# EAGLE design io-usb (EAGLE 9.3.0)
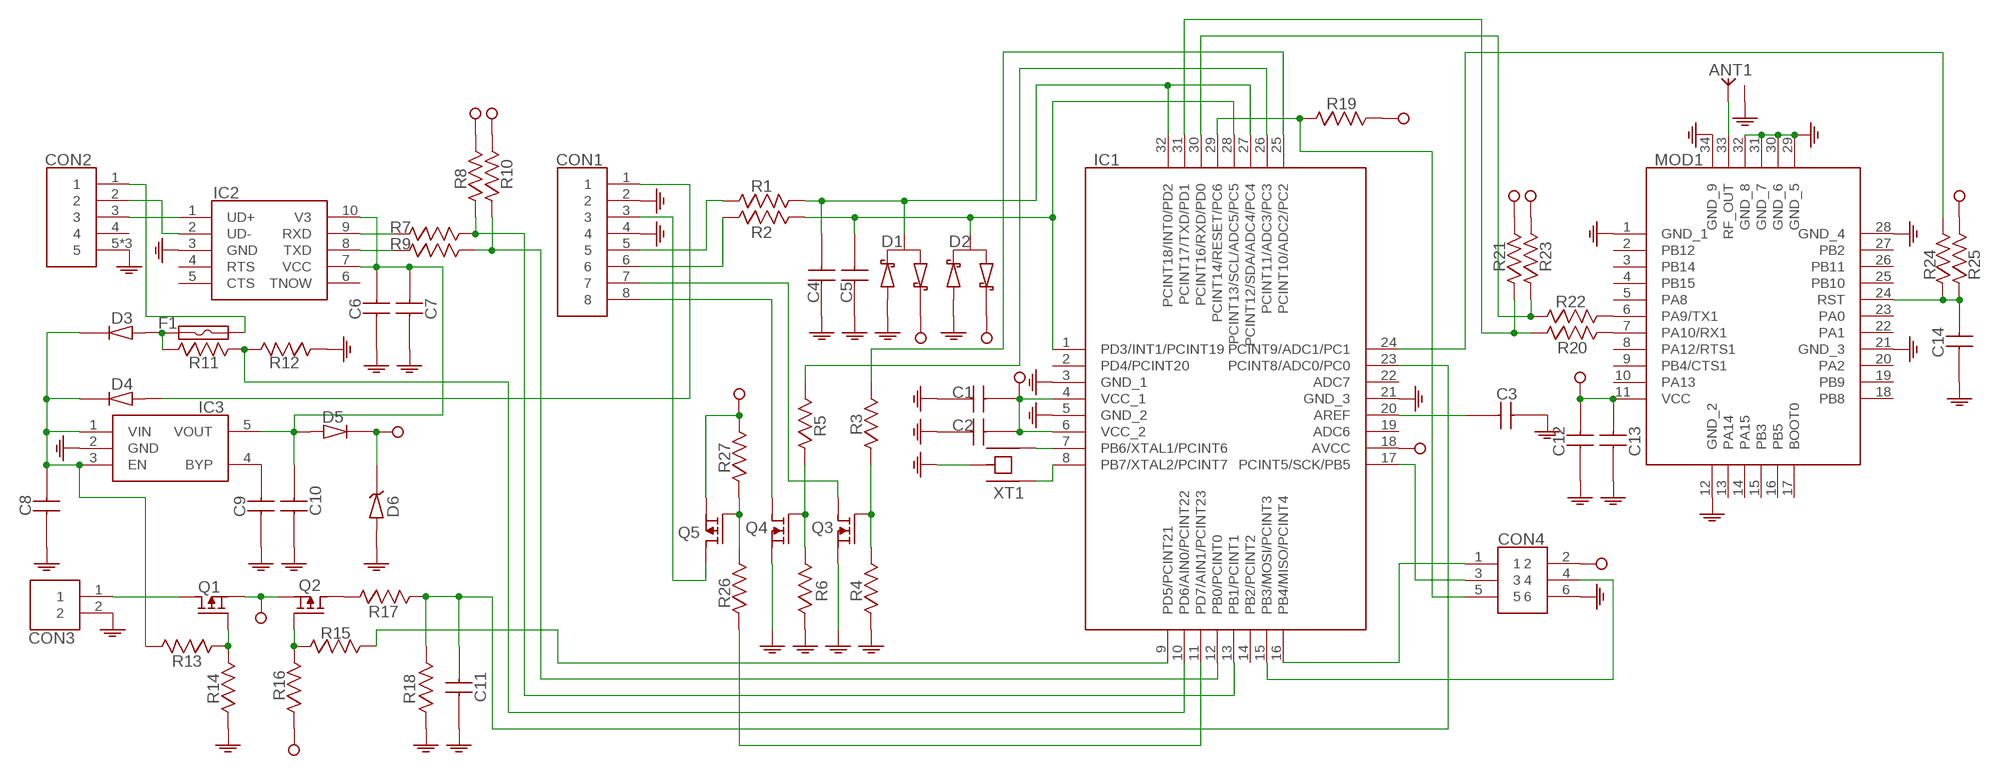
[diagram p0: schematic, sheet 1]

## Parts
ANT1  SMA-RF  [SMA-RF]
C1  CAPACITOR-0805  [0805]
C2  CAPACITOR-0603  [0603]
C3  CAPACITOR-0603  [0603]
C4  CAPACITOR-0603  [0603]
C5  CAPACITOR-0603  [0603]
C6  CAPACITOR-0805  [0805]
C7  CAPACITOR-0603  [0603]
C8  CAPACITOR-0805  [0805]
C9  CAPACITOR-0603  [0603]
C10  CAPACITOR-0805  [0805]
C11  CAPACITOR-0603  [0603]
C12  CAPACITOR-0603  [0603]
C13  CAPACITOR-0805  [0805]
C14  CAPACITOR-0603  [0603]
CON1  CON-89-3_81-PLUG  [CON-8P-3_81-PLUG]
CON2  USB-MICRO-DIP-VER  [USB-MICRO-DIP-VER]
CON3  JST-PH-2-2.0MM  [JST-PH-2-2.0MM]
CON4  ISP  [ISP]
D1  SCHOTTKY-SERIE-3P  [SOT23-3]
D2  SCHOTTKY-SERIE-3P  [SOT23-3]
D3  DIODE-SOD123  [SOD123-DIODE]
D4  DIODE-SOD123  [SOD123-DIODE]
D5  DIODE-SOD123  [SOD123-DIODE]
D6  ZENER-SOD123  [SOD123-DIODE]
F1  FUSE-0805  [0805]
IC1  ATMEGA328P-AU  [TQFP-32]
IC2  CH340E  [MSOP-10]
IC3  MIC5219  [SOT23-5]
MOD1  RAK811  [RAK811]
Q1  P-MOSFET  [SOT23-3]
Q2  P-MOSFET  [SOT23-3]
Q3  N-MOSFET  [SOT23-3]
Q4  N-MOSFET  [SOT23-3]
Q5  P-MOSFET  [SOT23-3]
R1  RESISTOR-0805  [0805]
R2  RESISTOR-0805  [0805]
R3  RESISTOR-0603  [0603]
R4  RESISTOR-0603  [0603]
R5  RESISTOR-0603  [0603]
R6  RESISTOR-0603  [0603]
R7  RESISTOR-0603  [0603]
R8  RESISTOR-0603  [0603]
R9  RESISTOR-0603  [0603]
R10  RESISTOR-0603  [0603]
R11  RESISTOR-0603  [0603]
R12  RESISTOR-0603  [0603]
R13  RESISTOR-0603  [0603]
R14  RESISTOR-0603  [0603]
R15  RESISTOR-0603  [0603]
R16  RESISTOR-0603  [0603]
R17  RESISTOR-0603  [0603]
R18  RESISTOR-0603  [0603]
R19  RESISTOR-0603  [0603]
R20  RESISTOR-0603  [0603]
R21  RESISTOR-0603  [0603]
R22  RESISTOR-0603  [0603]
R23  RESISTOR-0603  [0603]
R24  RESISTOR-0603  [0603]
R25  RESISTOR-0603  [0603]
R26  RESISTOR-0603  [0603]
R27  RESISTOR-0603  [0603]
XT1  RESONATOR-3215  [RESONATOR-3215]

## Nets
GND: ANT1.2(GND) ANT1.3(GND) ANT1.4(GND) ANT1.5(GND) C1.1 C2.1 C3.2 C4.1 C5.1 C6.1 C7.1 C8.1 C9.2 C10.1 C11.1 C12.1 C13.1 C14.1 CON1.2 CON1.4 CON2.5 CON2.6 CON2.7 CON3.2 CON4.6 D1.1 D2.1 D6.2(A) IC1.3(GND_1) IC1.5(GND_2) IC1.21(GND_3) IC2.3(GND) IC3.2(GND) MOD1.1(GND_1) MOD1.12(GND_2) MOD1.21(GND_3) MOD1.28(GND_4) MOD1.29(GND_5) MOD1.30(GND_6) MOD1.31(GND_7) MOD1.32(GND_8) MOD1.34(GND_9) Q3.2(S) Q4.2(S) R4.1 R6.1 R12.1 R14.1 R18.1 XT1.3
N$1: D3.2(A) F1.2 R11.1
N$2: C9.1 IC3.4(BYP)
N$3: IC2.9(RXD) R7.1
N$4: IC2.8(TXD) R9.1
N$5: CON2.3 IC2.1(UD+)
N$6: CON2.2 IC2.2(UD-)
N$8: CON3.1 Q1.3(D)
N$9: IC1.7(PB6/XTAL1/PCINT6) XT1.1
N$10: CON2.1 F1.1
N$11: IC1.8(PB7/XTAL2/PCINT7) XT1.2
N$12: IC1.9(PD5/PCINT21) R15.2
N$13: C8.2 D3.1(K) D4.1(K) IC3.1(VIN) IC3.3(EN) R13.2
N$14: Q2.1(G) R15.1 R16.2
N$15: C11.2 IC1.23(PCINT8/ADC0/PC0) R17.2 R18.2
N$16: CON1.1 D4.2(A)
N$17: ANT1.1(ANT) MOD1.33(RF_OUT)
N$18: MOD1.6(PA9/TX1) R22.2
N$19: MOD1.7(PA10/RX1) R20.2
N$20: C14.2 MOD1.24(RST) R24.1 R25.1
N$21: IC1.30(PCINT16/RXD/PD0) R22.1 R23.1
N$22: IC1.31(PCINT17/TXD/PD1) R20.1 R21.1
N$23: CON4.5 IC1.29(PCINT14/RESET/PC6) R19.1
N$24: IC1.13(PB1/PCINT1) R7.2 R8.1
N$25: C4.2 D1.3 IC1.27(PCINT12/SDA/ADC4/PC4) IC1.32(PCINT18/INT0/PD2) R1.2
N$26: IC1.12(PB0/PCINT0) R9.2 R10.1
N$27: CON1.6 R2.1
N$28: C5.2 D2.3 IC1.1(PD3/INT1/PCINT19) IC1.28(PCINT13/SCL/ADC5/PC5) R2.2
N$29: CON1.5 R1.1
N$30: Q4.1(G) R5.1 R6.2
N$31: Q3.1(G) R3.1 R4.2
N$32: IC1.26(PCINT11/ADC3/PC3) R5.2
N$33: IC1.25(PCINT10/ADC2/PC2) R3.2
N$34: CON1.7 Q3.3(D)
N$35: CON1.8 Q4.3(D)
N$36: IC1.24(PCINT9/ADC1/PC1) R24.2
N$37: Q1.1(G) R13.1 R14.2
N$38: Q2.3(D) R17.1
N$39: IC1.10(PD6/AIN0/PCINT22) R11.2 R12.2
N$40: CON4.3 IC1.17(PCINT5/SCK/PB5)
N$41: CON4.1 IC1.16(PB4/MISO/PCINT4)
N$42: CON4.4 IC1.15(PB3/MOSI/PCINT3)
N$43: C3.1 IC1.20(AREF)
N$44: Q5.1(G) R26.2 R27.1
N$45: CON1.3 Q5.3(D)
N$46: IC1.11(PD7/AIN1/PCINT23) R26.1
N$47: C6.2 C7.2 C10.2 D5.2(A) IC2.7(VCC) IC2.10(V3) IC3.5(VOUT)
VCC: C1.2 C2.2 C12.2 C13.2 CON4.2 D1.2 D2.2 D5.1(K) D6.1(K) IC1.4(VCC_1) IC1.6(VCC_2) IC1.18(AVCC) MOD1.11(VCC) Q1.2(S) Q2.2(S) Q5.2(S) R8.2 R10.2 R16.1 R19.2 R21.2 R23.2 R25.2 R27.2
Unconnected: CON2.4 IC1.14(PB2/PCINT2) IC1.19(ADC6) IC1.22(ADC7) IC2.4(RTS) IC2.5(CTS) IC2.6(TNOW) MOD1.2(PB12) MOD1.3(PB14) MOD1.4(PB15) MOD1.5(PA8) MOD1.8(PA12/RTS1) MOD1.9(PB4/CTS1) MOD1.10(PA13) MOD1.13(PA14) MOD1.14(PA15) MOD1.15(PB3) MOD1.16(PB5) MOD1.17(BOOT0) MOD1.18(PB8) MOD1.19(PB9) MOD1.20(PA2) MOD1.22(PA1) MOD1.23(PA0) MOD1.25(PB10) MOD1.26(PB11) MOD1.27(PB2)

## Power pins joined to a net without a drawn wire
PD4/PCINT20: IC1.2(PD4/PCINT20)

## Library data of the parts
ANT1 = SamacSys_Parts:SMA-RF
C1 C6 C8 C10 C13 = SamacSys_Parts:CAPACITOR-0805
C2-C5 C7 C9 C11 C12 C14 = SamacSys_Parts:CAPACITOR-0603
CON1 = SamacSys_Parts:CON-89-3_81-PLUG
CON2 = SamacSys_Parts:USB-MICRO-DIP-VER
CON3 = SamacSys_Parts:JST-PH-2-2.0MM
CON4 = SamacSys_Parts:ISP
D1 D2 = SamacSys_Parts:SCHOTTKY-SERIE-3P
D3-D5 = SamacSys_Parts:DIODE-SOD123
D6 = SamacSys_Parts:ZENER-SOD123
F1 = SamacSys_Parts:FUSE-0805
IC1 = SamacSys_Parts:ATMEGA328P-AU
IC2 = SamacSys_Parts:CH340E
IC3 = SamacSys_Parts:MIC5219
MOD1 = SamacSys_Parts:RAK811
Q1 Q2 Q5 = SamacSys_Parts:P-MOSFET
Q3 Q4 = SamacSys_Parts:N-MOSFET
R1 R2 = SamacSys_Parts:RESISTOR-0805
R3-R27 = SamacSys_Parts:RESISTOR-0603
XT1 = SamacSys_Parts:RESONATOR-3215

## Board
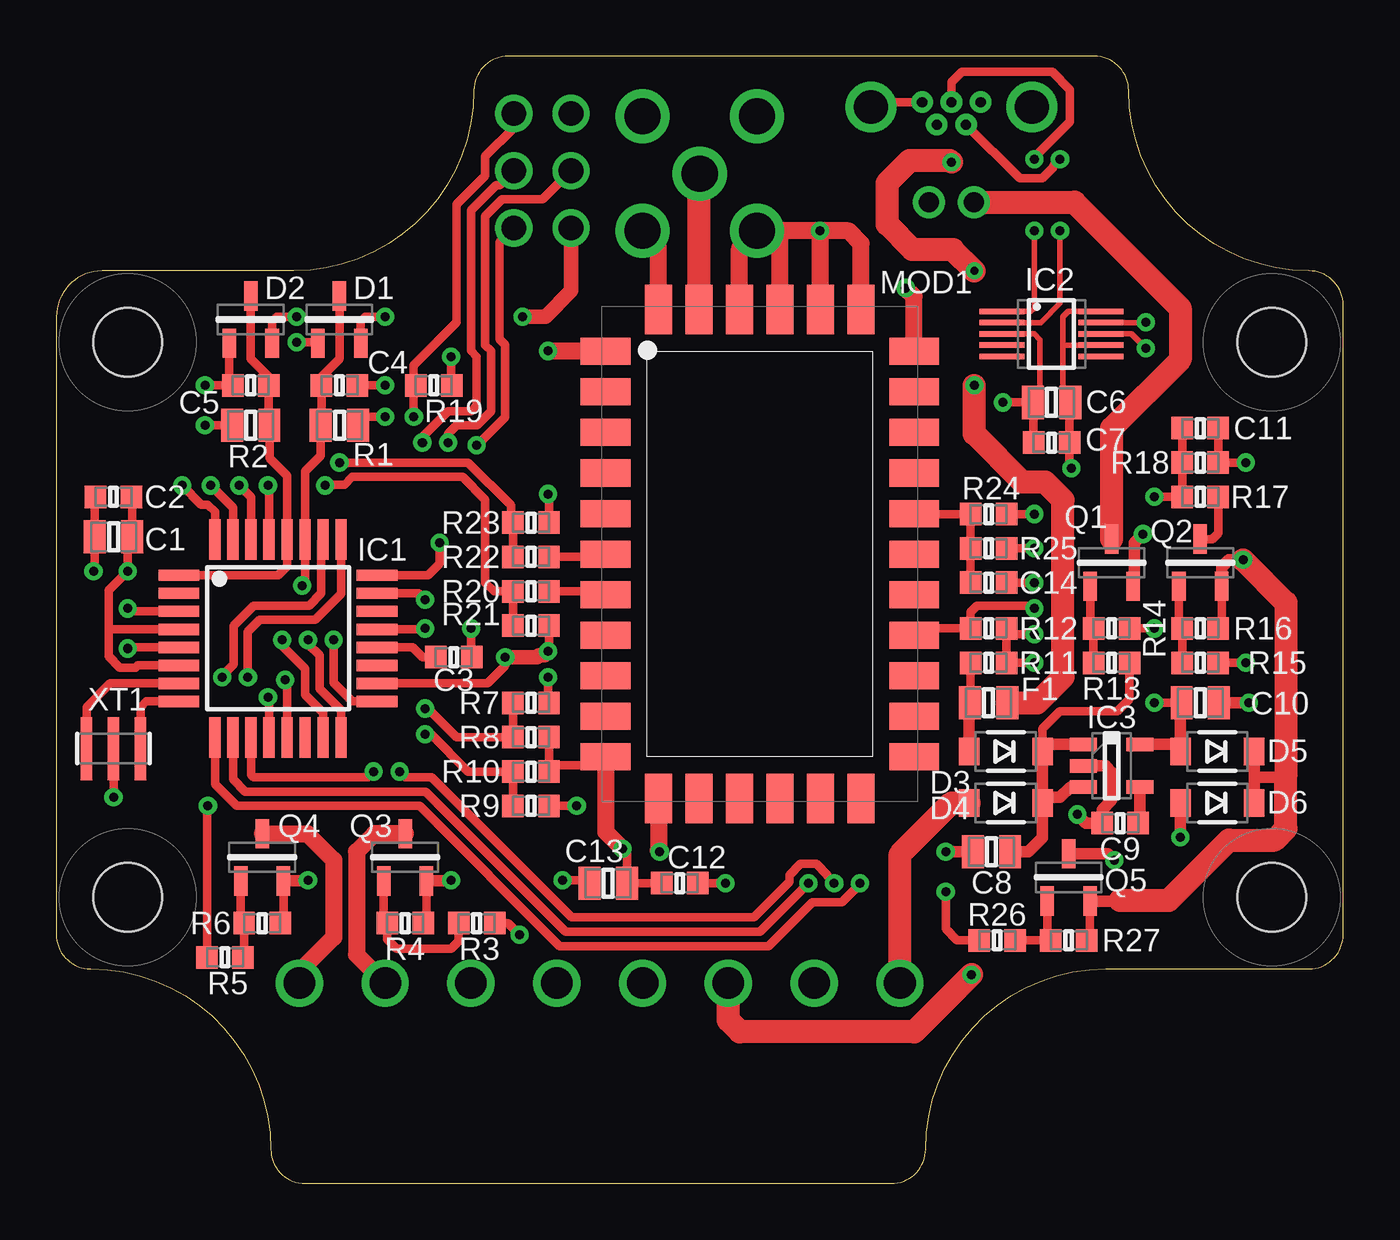
[diagram p1: board, top side]
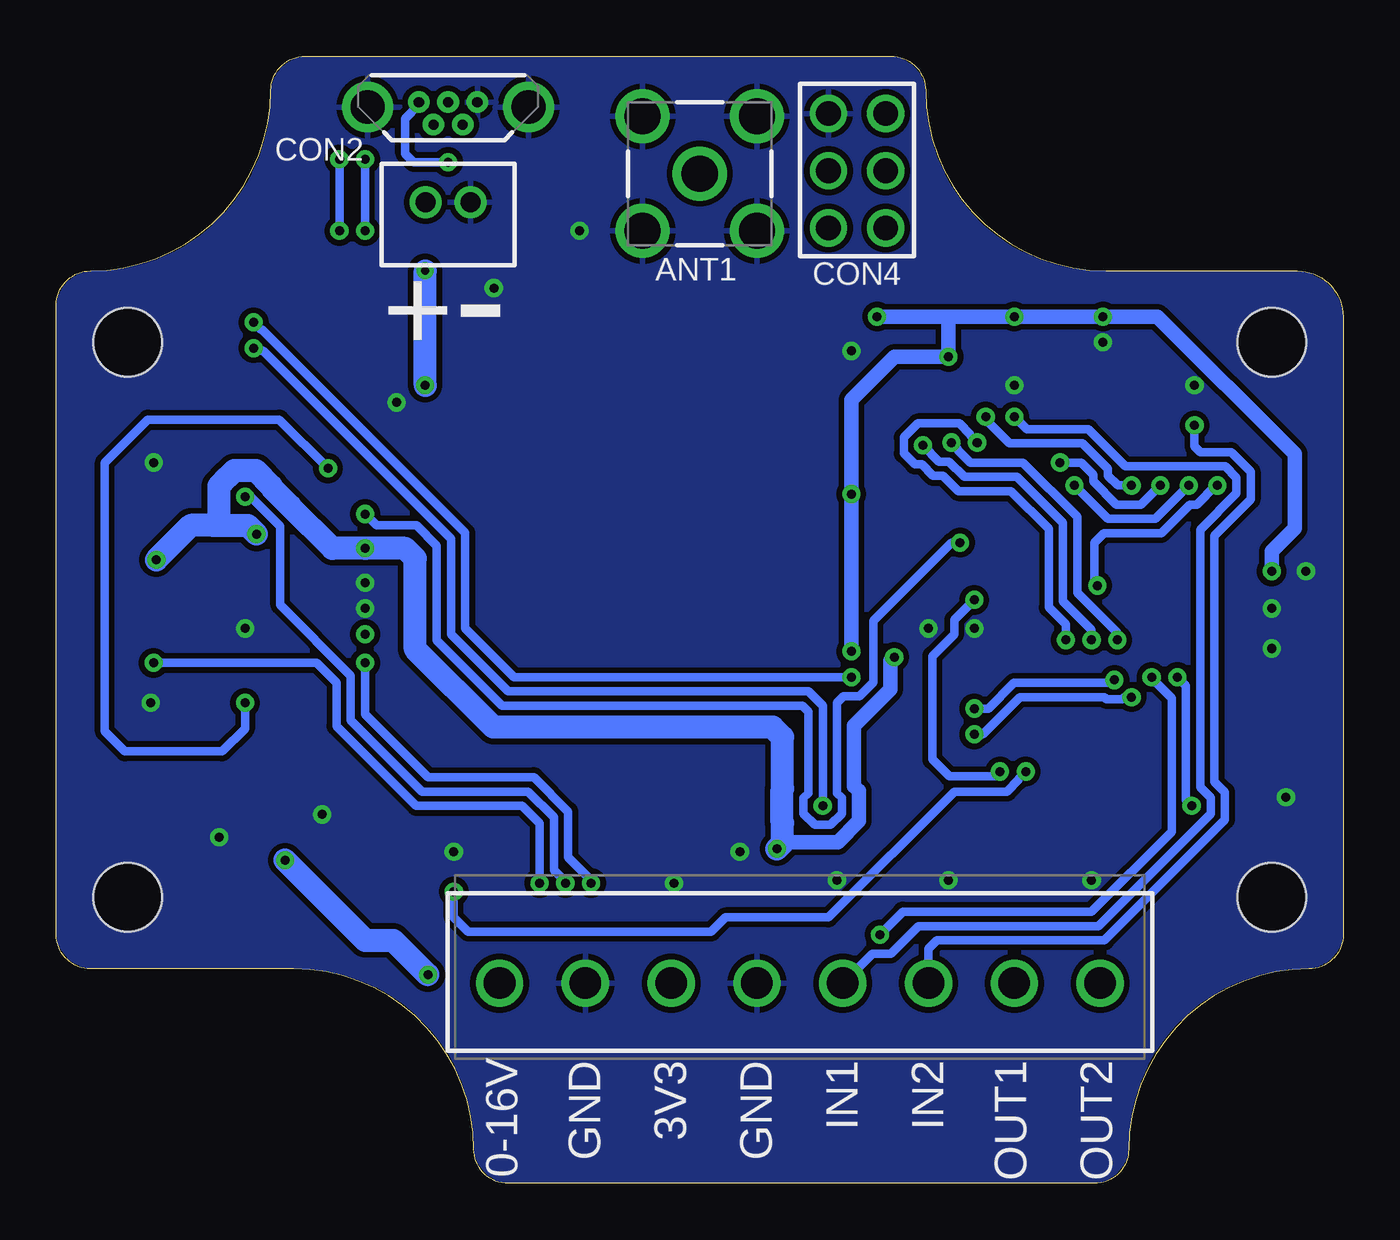
[diagram p2: board, bottom side, seen from below]

Size 57.15 x 50.04 mm. Coordinates in mm from the lower left corner, seen from the top.
Outline: 0,38.48 0,11.05 arc90 1.52,9.53 arc-90 9.53,1.52 arc90 11.05,0 37.08,0 arc90 38.61,1.52 arc-90 46.61,9.53 55.63,9.53 arc90 57.15,11.05 57.15,38.99 arc90 55.63,40.51 arc-90 47.62,48.51 arc90 46.1,50.04 20.07,50.04 arc90 18.54,48.51 arc-90 10.54,40.51 2.03,40.51 arc90 0,38.48
Copper layers (1*16): Top 0.035mm / dielectric 1.5mm / Bottom 0.035mm
Design rules "qfn *": minimum track width 9mil, minimum drill 0.35mm, track to track 10mil, track to pad 10mil, pad to pad 10mil, via to via 10mil, smd to smd 0mil, copper to edge 0mil, drill to drill 6mil, minimum pad ring 10mil, minimum via ring 8mil, stop-mask expansion 4mil, vias tented up to drill 17mil, thermal gap 10mil
Holes 3.05 mm at 3.17,37.34 53.98,37.34 3.17,12.7 53.98,12.7

### Footprints (pad centres in the part's own frame; a part is rotated, then mirrored left to right if it is on the bottom)
SMA-RF = drill 1.6: 1 0,0; 2 -2.54,2.54; 3 -2.54,-2.54; 4 2.54,-2.54; 5 2.54,2.54
0805 = smd 0.97 x 1.47: 1 -0.83,0; 2 0.83,0
0603 = smd 0.95 x 1: 1 -0.8,0; 2 0.8,0
CON-8P-3_81-PLUG = drill 1.4: 1 -13.335,0; 2 -9.525,0; 3 -5.715,0; 4 -1.905,0; 5 1.905,0; 6 5.715,0; 7 9.525,0; 8 13.335,0
USB-MICRO-DIP-VER = drill 0.45: 1 -1.3,0; 2 -0.65,-1; 3 0,0; 4 0.65,-1; 5 1.3,0 | drill 1.5: 6 -3.575,-0.22; 7 3.575,-0.22
JST-PH-2-2.0MM = drill 0.9: 1 -1,0; 2 1,0
ISP = drill 1.1 pad 1.65: 1 0,0; 2 2.54,0; 3 0,-2.54; 4 2.54,-2.54; 5 0,-5.08; 6 2.54,-5.08
SOT23-3 = smd 1.3 x 0.6: 1 -1.05,0.95; 2 -1.05,-0.95; 3 1.05,0
SOD123-DIODE = smd 0.91 x 1.22: 1 -1.635,0; 2 1.635,0
TQFP-32 = smd 1.8 x 0.5: 1 -4.4,2.8; 2 -4.4,2; 3 -4.4,1.2; 4 -4.4,0.4; 5 -4.4,-0.4; 6 -4.4,-1.2; 7 -4.4,-2; 8 -4.4,-2.8; 17 4.4,-2.8; 18 4.4,-2; 19 4.4,-1.2; 20 4.4,-0.4; 21 4.4,0.4; 22 4.4,1.2; 23 4.4,2; 24 4.4,2.8 | smd 0.5 x 1.8: 9 -2.8,-4.4; 10 -2,-4.4; 11 -1.2,-4.4; 12 -0.4,-4.4; 13 0.4,-4.4; 14 1.2,-4.4; 15 2,-4.4; 16 2.8,-4.4; 25 2.8,4.4; 26 2,4.4; 27 1.2,4.4; 28 0.4,4.4; 29 -0.4,4.4; 30 -1.2,4.4; 31 -2,4.4; 32 -2.8,4.4
MSOP-10 = smd 2 x 0.245: 1 -2.2,1; 2 -2.2,0.5; 3 -2.2,0; 4 -2.2,-0.5; 5 -2.2,-1; 6 2.2,-1; 7 2.2,-0.5; 8 2.2,0; 9 2.2,0.5; 10 2.2,1
SOT23-5 = smd 1.2 x 0.6: 1 -1.25,0.95; 2 -1.25,0; 3 -1.25,-0.95; 4 1.25,-0.95; 5 1.25,0.95
RAK811 = smd 2.2 x 1.2: 1 -6.85,9; 2 -6.85,7.2; 3 -6.85,5.4; 4 -6.85,3.6; 5 -6.85,1.8; 6 -6.85,0; 7 -6.85,-1.8; 8 -6.85,-3.6; 9 -6.85,-5.4; 10 -6.85,-7.2; 11 -6.85,-9; 18 6.85,-9; 19 6.85,-7.2; 20 6.85,-5.4; 21 6.85,-3.6; 22 6.85,-1.8; 23 6.85,0; 24 6.85,1.8; 25 6.85,3.6; 26 6.85,5.4; 27 6.85,7.2; 28 6.85,9 | smd 1.2 x 2.2: 12 -4.5,-10.85; 13 -2.7,-10.85; 14 -0.9,-10.85; 15 0.9,-10.85; 16 2.7,-10.85; 17 4.5,-10.85; 29 4.5,10.85; 30 2.7,10.85; 31 0.9,10.85; 32 -0.9,10.85; 33 -2.7,10.85; 34 -4.5,10.85
RESONATOR-3215 = smd 0.5 x 2.8: 1 -1.2,0; 2 1.2,0; 3 0,0

### Placement (x,y rotation side)
ANT1  28.57,44.83 0 bottom
C1  2.54,28.7 0 top
C2  2.54,30.48 0 top
C3  17.65,23.37 0 top
C4  12.57,35.43 180 top
C5  8.64,35.43 0 top
C6  44.2,34.67 0 top
C7  44.2,32.89 0 top
C8  41.53,14.73 0 top
C9  47.24,16 180 top
C10  50.8,21.34 180 top
C11  50.8,33.53 180 top
C12  27.69,13.34 180 top
C13  24.51,13.34 0 top
C14  41.4,26.67 180 top
CON1  24.13,8.89 0 bottom
CON2  39.75,48.01 0 bottom
CON3  39.75,43.56 0 bottom
CON4  20.32,42.42 180 bottom
D1  12.57,38.35 90 top
D2  8.64,38.35 90 top
D3  42.16,19.18 180 top
D4  42.16,16.89 180 top
D5  51.56,19.18 180 top
D6  51.56,16.89 180 top
F1  41.4,21.34 180 top
IC1  9.85,24.2 0 top
IC2  44.2,37.72 0 top
IC3  46.86,18.54 0 top
MOD1  31.24,27.94 0 top
Q1  46.86,27.56 90 top
Q2  50.8,27.56 90 top
Q3  15.49,14.48 90 top
Q4  9.14,14.48 90 top
Q5  44.96,13.59 90 top
R1  12.57,33.66 180 top
R2  8.64,33.66 0 top
R3  18.67,11.56 0 top
R4  15.49,11.56 180 top
R5  7.49,10.03 180 top
R6  9.14,11.56 180 top
R7  21.08,21.34 180 top
R8  21.08,19.81 0 top
R9  21.08,16.76 180 top
R10  21.08,18.29 0 top
R11  41.4,23.11 0 top
R12  41.4,24.64 0 top
R13  46.86,23.11 0 top
R14  46.86,24.64 180 top
R15  50.8,23.11 0 top
R16  50.8,24.64 180 top
R17  50.8,30.48 180 top
R18  50.8,32 180 top
R19  16.76,35.43 0 top
R20  21.08,26.29 0 top
R21  21.08,24.77 0 top
R22  21.08,27.81 0 top
R23  21.08,29.34 0 top
R24  41.4,29.72 0 top
R25  41.4,28.19 0 top
R26  41.78,10.79 0 top
R27  44.96,10.79 0 top
XT1  2.54,19.3 0 top

### Tracks (layer width: path | path; a pad name or v marks a point on that pad's centre or on a via)
GND  (via drill 0.4)
  Top 0.244: IC2.3 43.43,37.72 43.69,37.47
  Top 0.254: 43.69,37.47 43.69,34.99 C6.1
  Top 0.381: C14.1 v43.43,26.67 | v43.43,25.53 43.31,25.65 40.89,25.65 40.6,25.36 R12.1 38.39,24.64 MOD1.21 | R14.1 v48.77,24.64 | C11.1 R18.1 v52.83,32 | C7.1 43.4,34.64 C6.1 v42.04,34.67 | Q4.2 10.09,11.71 R6.1 | Q3.2 16.44,11.71 R4.1 | D2.1 7.69,35.58 C5.1 v6.6,35.43 | D1.1 11.59,37.34 v10.67,37.34 | C4.1 v14.61,35.43 | IC1.5 3.22,23.8 v3.17,23.75 | IC1.3 4.12,25.4 3.3,25.4 v3.17,25.53 | XT1.3 v2.54,17.14 | v29.72,13.34 C12.1 | C13.1 23.55,13.46 v22.48,13.46 | C2.1 1.71,30.45 C1.1 1.71,27.24 v1.65,27.18 | IC1.21 16.34,24.6 v16.38,24.64 | CON2.5 36.4,48.01 CON2.7 | C3.2 18.41,23.41 v18.41,24.64
  Top 0.508: IC3.2 46.61,18.54 46.86,18.29 46.86,17.02 46.44,16.6 C9.2 45.72,16 v45.34,16.38 | C10.1 v52.96,21.34 | D6.2 49.93,15.38 v49.91,15.37 | C8.1 v39.5,14.73 | Q4.2 11.14,13.43 v11.18,13.46 | Q3.2 17.49,13.43 v17.53,13.46
  Top 0.762: MOD1.12 26.74,14.79 v26.8,14.73 | MOD1.34 26.74,41.58 ANT1.4 | MOD1.32 30.34,41.52 ANT1.3 32.13,42.29 | MOD1.29 35.74,41.73 35.18,42.29 v33.91,42.29 | v33.91,42.29 32.13,42.29 | MOD1.30 33.94,42.26 v33.91,42.29 | 32.13,42.29 32.14,42.28 MOD1.31 | MOD1.1 21.86,36.94 v21.84,36.96 | MOD1.28 38.09,39.38 v37.72,39.75
  pour Bottom: 1.65,9.65 arc-90 0.13,11.18 0.13,38.35 arc-90 2.16,40.39 10.67,40.39 arc90 18.67,48.39 arc-90 20.19,49.91 45.97,49.91 arc-90 47.5,48.39 arc90 55.5,40.39 arc-90 57.02,38.86 57.02,11.18 arc-90 55.5,9.65 46.48,9.65 arc90 38.48,1.65 arc-90 36.96,0.13 11.18,0.13 arc-90 9.65,1.65 arc90
N$1
  Top 0.381: R11.1 40.6,21.37 F1.2
  Top 0.508: D3.2 40.53,21.29 F1.2
N$2
  Top 0.508: IC3.4 48.11,16.07 C9.1
N$3  (via drill 0.4)
  Top 0.236: IC2.9 48.38,38.22
  Top 0.254: 48.38,38.22 v48.39,38.23
  Top 0.381: R7.1 21.84,21.37 v21.84,22.48
  Bottom 0.381: v48.39,38.23 48.09,37.93 48.04,37.93 38.99,28.89 38.99,24.65 36.82,22.48 v21.84,22.48
N$4  (via drill 0.4)
  Top 0.244: IC2.8 47.75,37.72
  Top 0.254: 47.75,37.72 v48.39,37.08
  Top 0.381: R9.1 v23.11,16.76
  Bottom 0.381: v48.39,37.08 48.26,36.96 47.96,36.96 39.62,28.62 39.62,24.38 37.08,21.84 23.75,21.84 23.11,21.21 v23.11,16.76
N$5  (via drill 0.4)
  Top 0.244: IC2.1 43.29,38.72 43.43,38.86
  Top 0.254: 43.43,38.86 v43.43,42.29
  Top 0.381: v43.43,45.47 43.43,45.55 45.02,47.14 45.02,48.56 44.23,49.35 40.21,49.35 39.75,48.9 CON2.3
  Bottom 0.381: v43.43,42.29 v43.43,45.47
N$6  (via drill 0.4)
  Top 0.244: IC2.2 43.72,38.22
  Top 0.254: v44.58,42.29 44.58,39.07 43.72,38.22
  Top 0.381: v44.58,45.47 44.28,45.17 44.28,45.12 43.78,44.62 42.79,44.62 CON2.2
  Bottom 0.381: v44.58,45.47 v44.58,42.29
N$8
  Top 1.016: CON3.1 45.21,43.56 49.91,38.86 49.91,36.58 46.86,33.53 Q1.3
N$9
  Top 0.381: IC1.7 2.39,22.2 1.34,21.15 XT1.1
N$10  (via drill 0.35, 0.4)
  Top 1.016: F1.1 43.56,21.34 44.7,22.48 44.7,30.35 43.92,31.14 42.9,31.14 40.77,33.27 v40.77,35.43 | v39.75,45.34 39.68,45.41 37.89,45.41 36.9,44.42 36.9,42.57 38.02,41.46 39.82,41.46 v40.77,40.51
  Bottom 0.381: v39.75,45.34 41.27,45.34 41.66,45.72 41.66,47.27 41.05,47.88 CON2.1
  Bottom 1.016: v40.77,35.43 v40.77,40.51
N$11
  Top 0.381: IC1.8 4,21.4 3.74,21.14 XT1.2
N$12  (via drill 0.4)
  Top 0.381: v52.83,23.11 R15.2 | IC1.9 7.05,17.72 8,16.76 16.13,16.76 22.35,10.54 31.62,10.54 33.57,12.49 34.9,12.49 35.69,13.28 v35.69,13.34
  Bottom 0.381: v52.83,23.11 45.59,23.11 44.7,22.23 44.7,20.3 41.17,16.76 36.47,16.76 35.69,15.98 v35.69,13.34
N$13
  Top 0.381: D3.1 43.8,20.18 44.58,20.95 47.12,20.95 47.66,21.5 R13.2
  Top 0.508: IC3.1 44.11,19.49 D3.1 43.8,17.27 | 43.8,17.27 D4.1 43.8,15.35 43.18,14.73 C8.2 | IC3.3 45.02,17.59 44.58,17.14 43.93,17.14 43.8,17.27
N$14
  Top 0.381: Q2.1 49.85,24.79 R16.2 R15.1
N$15  (via drill 0.4)
  Top 0.381: C11.2 R18.2 R17.2 v48.77,30.48 | v34.54,13.34 34.25,13.63 34.25,13.69 33.75,14.18 33.05,14.18 32.55,13.69 32.55,13.38 30.98,11.81 22.89,11.81 16.66,18.03 15.49,18.03 v15.24,18.29 | IC1.23 16.09,26.2 v16.38,25.91
  Bottom 0.381: v34.54,13.34 34.54,13.39 35.05,13.9 35.05,16.25 36.2,17.4 40.9,17.4 44.07,20.57 44.07,22.55 47.2,25.68 47.2,29.17 48.51,30.48 v48.77,30.48 | v15.24,18.29 15.45,18.07 17.5,18.07 18.25,18.83 18.25,23.41 17.27,24.38 17.27,25.02 v16.38,25.91
N$16
  Top 1.016: CON1.1 37.47,14.61 39.75,16.89 D4.2
N$17
  Top 1.016: MOD1.33 28.54,44.8 ANT1.1
N$18
  Top 0.381: MOD1.6 24.27,27.81 R22.2
N$19
  Top 0.381: R20.2 24.24,26.29 MOD1.7
N$20
  Top 0.381: MOD1.24 38.11,29.72 R24.1 R25.1 C14.2
N$21  (via drill 0.4)
  Top 0.381: R22.1 R23.1 20.19,29.43 20.19,30.11 18.3,32 v12.57,32 | IC1.30 8.65,30.47 v8.13,30.99
  Bottom 0.381: v8.13,30.99 8.98,30.14 10.06,30.14 11.09,31.16 11.09,31.47 11.63,32 v12.57,32
N$22  (via drill 0.4)
  Top 0.381: R21.1 R20.1 19.43,26.29 19.05,26.67 19.05,30.35 18.03,31.37 13.14,31.37 12.8,31.03 11.98,31.03 v11.94,30.99 | IC1.31 7.85,30 v6.86,30.99
  Bottom 0.381: v6.86,30.99 8.34,29.5 10.46,29.5 v11.94,30.99
N$23  (via drill 0.4)
  Top 0.381: IC1.29 9.45,30.94 v9.4,30.99 | R19.1 15.88,35.34 | 15.88,35.34 v15.88,34.04 | CON4.5 20.32,46.86 19.05,45.59 19.05,44.74 17.78,43.47 17.78,38.23 15.88,36.32 15.88,35.34
  Bottom 0.381: v9.4,30.99 10.02,30.99 10.46,31.43 10.46,31.73 11.58,32.85 14.82,32.85 15.88,33.91 v15.88,34.04
N$24  (via drill 0.4)
  Top 0.381: IC1.13 10.25,22.27 v10.16,22.35 | R7.2 R8.1 17.78,19.81 16.51,21.08 v16.38,21.08
  Bottom 0.381: v16.38,21.08 15.76,21.08 14.61,22.23 10.29,22.23 v10.16,22.35
N$25  (via drill 0.4)
  Top 0.381: D1.3 12.57,36.62 11.77,35.82 C4.2 11.77,33.43 11.74,33.4 | R1.2 11.74,33.4 | 11.74,33.4 11.74,32.32 11.05,31.62 IC1.27 11.05,26.67 v10.92,26.54 | IC1.32 7.05,29.82 6.73,30.14 6.44,30.14 v5.59,30.99
  Bottom 0.381: v5.59,30.99 5.66,30.99 6.51,30.14 6.81,30.14 8.08,28.87 10.63,28.87 11.05,28.45 11.05,26.67 v10.92,26.54
N$26  (via drill 0.4)
  Top 0.381: IC1.12 9.45,21.54 v9.4,21.59 | R9.2 R10.1 18.29,18.29 16.64,19.94 v16.38,19.94
  Bottom 0.381: v9.4,21.59 9.72,21.59 9.81,21.5 10.51,21.5 10.6,21.59 14.35,21.59 16,19.94 v16.38,19.94
N$27  (via drill 0.4)
  Top 0.381: R2.1 v6.6,33.66
  Bottom 0.381: v6.6,33.66 6.6,32.73 6.35,32.47 4.97,32.47 4.11,31.6 4.11,30.37 5.71,28.76 5.71,17.84 5.25,17.38 5.25,16.15 10.6,10.79 18.03,10.79 18.41,10.41 CON1.6
N$28
  Top 0.381: D2.3 8.64,36.62 9.56,35.69 9.56,35.56 C5.2 9.44,33.69 R2.2 9.47,32.19 10.25,31.41 IC1.28 10.25,27.39 9.85,27 IC1.1
N$29  (via drill 0.4)
  Top 0.381: v14.61,34.04 13.78,34.04 R1.1
  Bottom 0.381: v14.61,34.04 14.06,33.49 11.31,33.49 9.66,31.84 5.24,31.84 4.74,31.34 4.74,30.64 6.35,29.03 6.35,17.58 5.88,17.11 5.88,16.41 10.87,11.43 18.87,11.43 20.1,10.2 20.91,10.2 CON1.5
N$30
  Top 0.381: Q4.1 8.19,11.71 R6.2 8.34,10.08 R5.1
N$31
  Top 0.381: Q3.1 14.54,11.71 R4.2 14.69,10.83 15.11,10.41 17.53,10.41 17.87,10.76 R3.1
N$32  (via drill 0.4)
  Top 0.381: IC1.26 11.77,28.52 11.77,26.19 11.23,25.65 8.76,25.65 7.87,24.77 7.87,23.04 7.37,22.54 v7.37,22.48 | R5.2 6.69,16.73 v6.73,16.76
  Bottom 0.381: v7.37,22.48 6.99,22.1 6.99,17.02 v6.73,16.76
N$33  (via drill 0.4)
  Top 0.381: IC1.25 12.65,26.17 11.49,25.02 9.03,25.02 8.51,24.5 v8.51,22.48 | v20.57,11.05 20.07,11.56 R3.2
  Bottom 0.381: v20.57,11.05 19.56,12.06 11.18,12.06 7.62,15.62 7.62,21.53 8.51,22.42 v8.51,22.48
N$34
  Top 0.762: Q3.3 14.13,15.53 13.34,14.73 13.34,10.16 CON1.7
N$35
  Top 0.762: Q4.3 11.14,15.53 12.32,14.35 12.32,10.92 10.79,9.4 CON1.8
N$36  (via drill 0.4)
  Top 0.381: R24.2 v43.43,29.72 | IC1.24 16.51,27 17.02,27.5 v17.02,28.45
  Bottom 0.381: v43.43,29.72 42.93,29.21 41.15,29.21 40.26,28.32 40.26,24.12 37.35,21.21 24.01,21.21 23.75,20.95 23.75,17.33 23.96,17.11 23.96,16.41 23.46,15.92 22.76,15.92 22.27,16.41 22.27,17.11 22.48,17.33 22.48,21.34 22.18,21.63 21.49,21.63 20.87,22.25 20.87,24.98 17.4,28.45 v17.02,28.45
N$37
  Top 0.381: Q1.1 45.91,24.79 R14.2 R13.1
N$38
  Top 0.381: Q2.3 51.34,28.61 51.6,28.87 R17.1
N$39  (via drill 0.4)
  Top 0.381: v43.43,24.38 42.46,24.38 R12.2 R11.2 v43.43,23.11 | v33.4,13.34 31.24,11.18 22.62,11.18 16.4,17.4 8.38,17.4 7.85,17.93 IC1.10
  Bottom 0.381: v43.43,23.11 43.43,20.83 40.64,18.03 35.94,18.03 34.42,16.51 34.42,14.48 33.4,13.46 v33.4,13.34
N$40  (via drill 0.4)
  Top 0.381: CON4.3 19.68,44.32 19.53,44.32 18.41,43.21 18.41,36.96 18.67,36.7 18.67,34.54 18.41,34.29 17.4,34.29 16.26,33.15 v16.26,32.89 | IC1.17 13.15,21.4 12.32,22.23 v12.32,24.13
  Bottom 0.381: v16.26,32.89 16.55,33.19 16.55,33.24 17.05,33.74 18.89,33.74 19.52,33.12 19.52,32.41 19.02,31.92 18.72,31.92 18.21,31.41 17.77,31.41 17.09,30.73 14.75,30.73 13.08,29.07 13.08,25.58 12.32,24.82 v12.32,24.13
N$41  (via drill 0.4)
  Top 0.381: IC1.16 12.65,21 11.68,21.96 11.68,23.44 11.18,23.95 v11.18,24.13 | CON4.1 19.68,41.78 19.68,37.48 19.94,37.23 19.94,34.02 18.69,32.77 v18.67,32.77
  Bottom 0.381: v18.67,32.77 17.95,32.05 17.5,32.05 16.83,31.37 14.49,31.37 12.45,29.33 12.45,25.84 11.18,24.57 v11.18,24.13
N$42  (via drill 0.4)
  Top 0.381: CON4.4 21.59,43.69 19.79,43.69 19.05,42.94 19.05,37.22 19.3,36.97 19.3,34.28 18.68,33.66 17.78,33.66 17.4,33.27 v17.4,32.89 | IC1.15 11.85,20.9 11.05,21.7 11.05,22.86 10.03,23.88 v10.03,24.13
  Bottom 0.381: v17.4,32.89 17.1,32.6 17.1,32.54 16.57,32 14.22,32 11.81,29.59 11.81,26.22 10.03,24.44 v10.03,24.13
N$43
  Top 0.381: IC1.20 15.83,23.8 16.26,23.37 C3.1
N$44
  Top 0.381: Q5.1 44.01,10.95 R27.1 R26.2
N$45  (via drill 0.4)
  Top 0.508: v46.99,14.35 46.7,14.64 Q5.3
  Top 1.016: v40.64,9.27 38.1,6.73 30.35,6.73 29.84,7.24 CON1.3
  Bottom 1.016: v46.99,14.35 43.43,10.79 42.19,10.79 40.66,9.27 v40.64,9.27
N$46  (via drill 0.4)
  Top 0.381: IC1.11 8.65,18.15 8.76,18.03 13.84,18.03 v14.1,18.29 | R26.1 40.01,10.79 39.5,11.3 v39.5,12.95
  Bottom 0.381: v14.1,18.29 14.39,17.99 14.39,17.94 14.93,17.4 17.27,17.4 22.86,11.81 27.43,11.81 28.07,11.18 38.86,11.18 39.5,11.81 v39.5,12.95
N$47  (via drill 0.4)
  Top 0.244: IC2.10 44.94,38.72 | IC2.7 44.71,37.22
  Top 0.254: 44.94,38.72 44.7,38.48 44.7,37.21 | 44.7,37.21 44.7,34.99 C6.2 | 44.71,37.22 44.7,37.21
  Top 0.381: C6.2 45,34.64 C7.2 45,31.84 v45.09,31.75 | C10.2 v48.77,21.34
  Top 0.508: IC3.5 49.61,19.49 D5.2 49.93,21.2 50.02,21.29 C10.2
  Bottom 0.381: v48.77,21.34 48.77,20.19 49.78,19.18 54.1,19.18 54.99,20.07 54.99,32 53.09,33.91 47.24,33.91 v45.09,31.75
VCC  (via drill 0.4)
  Top 0.381: R23.2 21.88,30.57 v21.84,30.61 | R21.2 21.88,23.66 v21.84,23.62 | R25.2 v43.43,28.19 | Q2.2 51.75,24.79 R16.1 | D2.2 9.59,38.29 9.78,38.48 v10.67,38.48 | D1.2 13.52,38.29 13.72,38.48 v14.61,38.48 | R19.2 17.53,35.47 v17.53,36.7 | MOD1.11 24.01,18.56 22.15,18.56 R10.2 R8.2 | C12.2 C13.2 25.34,14.66 v25.15,14.86 | IC1.6 3.62,23 3.53,22.9 2.82,22.9 2.33,23.4 2.33,24.51 | C2.2 3.37,30.45 C1.2 3.17,28.51 v3.17,27.18 2.33,26.33 2.33,24.51 | IC1.4 2.41,24.6 2.33,24.51 | IC1.18 19.15,22.2 19.94,22.99 v19.94,23.37 | Q5.2 45.91,10.95 R27.2
  Top 0.508: D5.1 53.2,18.03 | 53.2,18.03 D6.1 | Q1.2 47.88,26.57 47.88,28.45 v48.26,28.83 | Q2.2 51.75,27.37 52.07,27.69 v52.7,27.69 | 53.2,18.03 54.48,18.03 54.61,18.16 | Q5.2 47.21,12.54 47.24,12.57
  Top 0.635: v19.94,23.37 21.36,23.37 21.44,23.45 21.68,23.45 21.88,23.66 | CON4.2 22.86,39.62 21.72,38.48 v20.7,38.48
  Top 0.762: MOD1.11 24.39,15.61 v25.15,14.86
  Top 1.016: v52.7,27.69 54.61,25.78 54.61,18.16 54.61,15.75 54.1,15.24 52.07,15.24 49.4,12.57 47.24,12.57
  Bottom 0.635: 17.65,38.48 v14.61,38.48 v10.67,38.48 8.26,38.48 2.16,32.38 2.16,29.08 3.17,28.07 v3.17,27.18 | 17.65,38.48 17.53,38.35 v17.53,36.7 19.94,36.7 21.84,34.8 v21.84,30.61 v21.84,23.62 | v19.94,23.37 20.11,23.2 20.11,21.94 21.72,20.33 21.72,17.64 21.5,17.43 21.5,16.1 22.45,15.15 24.85,15.15 24.89,15.11 | 17.65,38.48 v20.7,38.48
  Bottom 1.016: 50.16,29.21 51.18,29.21 v52.7,27.69 | 50.16,29.21 48.64,29.21 v48.26,28.83 | v25.15,14.86 24.89,15.11 24.89,16 24.91,16.02 24.91,17.51 24.89,17.53 24.89,19.81 25.34,20.26 37.74,20.26 41.21,23.73 41.21,27.75 41.66,28.19 v43.43,28.19 44.88,28.19 46.76,30.07 47.6,30.92 47.6,30.96 48.28,31.64 49.25,31.64 49.53,31.37 49.93,30.96 49.93,29.44 50.16,29.21

### Text on the board
bNames: - | + | 0-16V | OUT2 | OUT1 | IN2 | IN1 | GND | 3V3 | GND